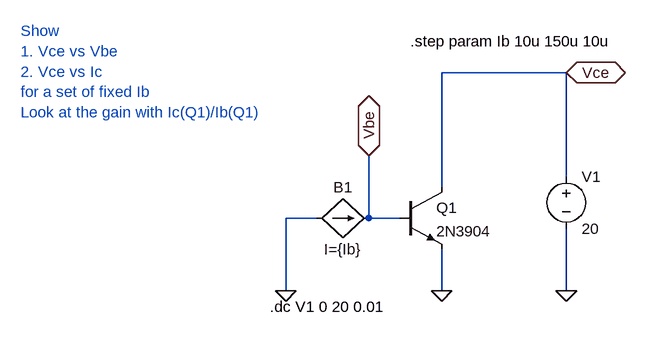
[diagram p0: schematic transistor_Vce_Vbe_and_Vce_Ic_curves.asc]
transistor_Vce_Vbe_and_Vce_Ic_curves.asc, the LTspice schematic file:
Version 4
SHEET 1 880 680
WIRE 384 -32 192 -32
WIRE 384 128 384 -32
WIRE 192 144 192 -32
WIRE 0 192 -48 192
WIRE 80 192 80 96
WIRE 128 192 80 192
WIRE -48 304 -48 192
WIRE 192 304 192 240
WIRE 384 304 384 208
FLAG -48 304 0
FLAG 192 304 0
FLAG 384 304 0
FLAG 80 96 Vbe
IOPIN 80 96 BiDir
FLAG 384 -32 Vce
IOPIN 384 -32 BiDir
SYMBOL npn 128 144 R0
SYMATTR InstName Q1
SYMATTR Value 2N3904
SYMBOL bi 0 192 R270
WINDOW 0 32 40 VTop 2
WINDOW 3 -32 40 VBottom 2
SYMATTR InstName B1
SYMATTR Value I={Ib}
SYMBOL voltage 384 112 R0
WINDOW 123 0 0 Left 0
WINDOW 39 0 0 Left 0
SYMATTR InstName V1
SYMATTR Value 20
TEXT -72 328 Left 2 !.dc V1 0 20 0.01
TEXT -456 -96 Left 2 ;Show \n1. Vce vs Vbe\n2. Vce vs Ic\nfor a set of fixed Ib\nLook at the gain with Ic(Q1)/Ib(Q1)
TEXT 144 -80 Left 2 !.step param Ib 10u 150u 10u

The netlist it stands for:
* transistor_Vce_Vbe_and_Vce_Ic_curves.asc
Q1 Vce Vbe 0 0 2N3904
B1 0 Vbe I={Ib}
V1 Vce 0 20
.model NPN NPN
.model PNP PNP
.lib standard.bjt
.dc V1 0 20 0.01
* Show
* 1. Vce vs Vbe
* 2. Vce vs Ic
* for a set of fixed Ib
* Look at the gain with Ic(Q1)/Ib(Q1)
.step param Ib 10u 150u 10u
.backanno
.end